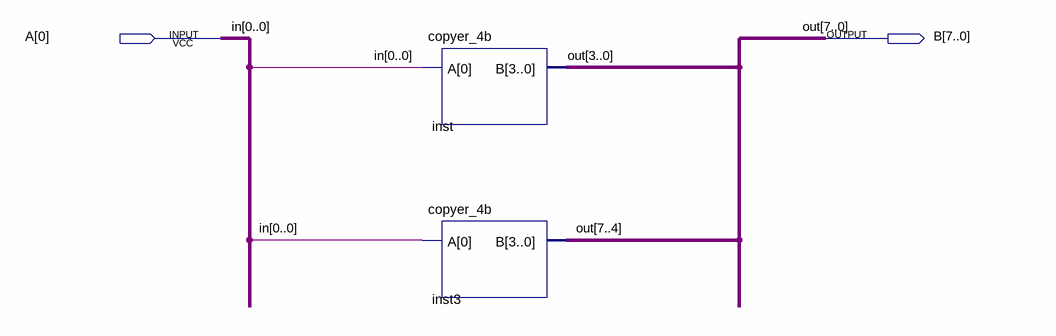
[diagram p0: schematic sheet]
// Quartus schematic copyer_8b.bdf as structural Verilog: 2 symbols, 2 pins
module copyer_8b (
  input  [0:0] A,
  output [7:0] B
);

  copyer_4b inst (.A(A[0]), .B(B[3:0]));
  copyer_4b inst3 (.A(A[0]), .B(B[7:4]));

  // Other names for the same wires on the sheet: in[0] = A[0]; out[7:0] = B
endmodule
